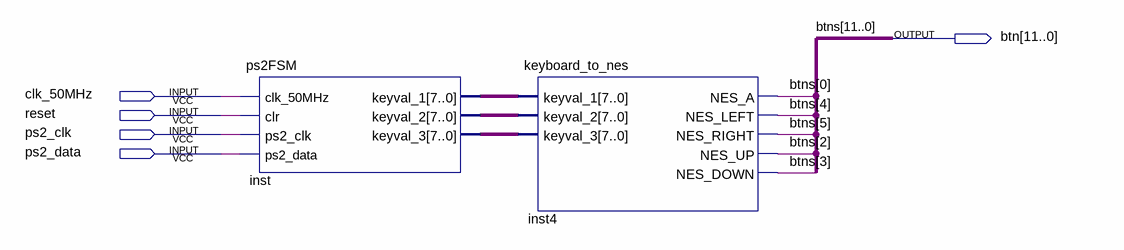
[diagram p0: schematic sheet]
// Quartus schematic ps2decoder.bdf as structural Verilog: 2 symbols, 5 pins
module ps2decoder (
  input  clk_50MHz,
  input  reset,
  input  ps2_clk,
  input  ps2_data,
  output [11:0] btn
);

  wire [7:0] inst_keyval_1, inst_keyval_2, inst_keyval_3;

  ps2FSM inst (
    .clk_50MHz(clk_50MHz), .clr(reset), .ps2_clk(ps2_clk), .ps2_data(ps2_data), .keyval_1(inst_keyval_1),
    .keyval_2(inst_keyval_2), .keyval_3(inst_keyval_3));
  keyboard_to_nes inst4 (
    .keyval_1(inst_keyval_1), .keyval_2(inst_keyval_2), .keyval_3(inst_keyval_3), .NES_A(btn[0]),
    .NES_LEFT(btn[4]), .NES_RIGHT(btn[5]), .NES_UP(btn[2]), .NES_DOWN(btn[3]));

  // Other names for the same wires on the sheet: btns[11:0] = btn
endmodule
